# Altium schematic sheet 语音合成.SchDoc
size A4
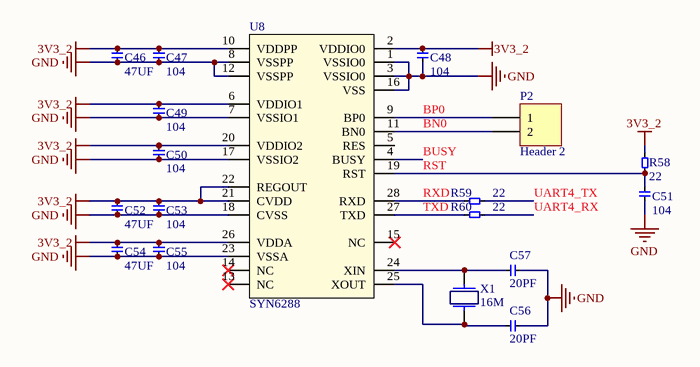
[diagram p0: 语音合成.SchDoc]

## Parts
C46  47UF  [C_1206]
C47  104  [C_0603]
C48  104  [C_0603]
C49  104  [C_0603]
C50  104  [C_0603]
C51  104  [C_0603]
C52  47UF  [C_1206]
C53  104  [C_0603]
C54  47UF  [C_1206]
C55  104  [C_0603]
C56  20PF  [C_0603]
C57  20PF  [C_0603]
P2  Header 2  [HDR1X2]
R58  22  [R_0603]
R59  22  [R_0603]
R60  22  [R_0603]
U8  SYN6288  [SSOP28]
X1  value 16M  [XTAL_DIP]  (hidden comment: xtal)

## Nets
3V3_2: C46.2 C47.2 C48.2 C49.2 C50.2 C52.2 C53.2 C54.2 C55.2 R58.2 U8.2(VDDIO0) U8.6(VDDIO1) U8.10(VDDPP) U8.20(VDDIO2) U8.21(CVDD) U8.22(REGOUT) U8.26(VDDA)
GND: C46.1 C47.1 C48.1 C49.1 C50.1 C51.1 C52.1 C53.1 C54.1 C55.1 C56.2 C57.2 U8.1(VSSIO0) U8.3(VSSIO0) U8.7(VSSIO1) U8.8(VSSPP) U8.12(VSSPP) U8.16(VSS) U8.17(VSSIO2) U8.18(CVSS) U8.23(VSSA)
BN0: P2.2 U8.11(BN0)
BP0: P2.1 U8.9(BP0)
BUSY: U8.4(BUSY)
RST: C51.2 R58.1 U8.19(RST)
RXD: R59.1 U8.28(RXD)
TXD: R60.1 U8.27(TXD)
UART4_RX: R60.2
UART4_TX: R59.2
NetC56_1: C56.1 U8.25(XOUT) X1.2
NetC57_1: C57.1 U8.24(XIN) X1.1

Not connected (* = marked no-connect by the designer): U8 5(RES) 13(NC)* 14(NC)* 15(NC)*

## Library data of the parts
C46-C57 = C_无极贴片: 无极性贴片电容
P2 = Header 2: Header, 2-Pin; LatestRevisionDate: 17-Jul-2002; LatestRevisionNote: Re-released for DXP Platform.; Publisher: Altium Limited
R58-R60 = R_贴片: 贴片电阻